# Altium project FMCW-Radar-v1.PrjPcb (part 2 of 3)

## Sheet Receiver-2.4GHz.SchDoc
size B; SheetNumber: 3; SheetTotal: 4
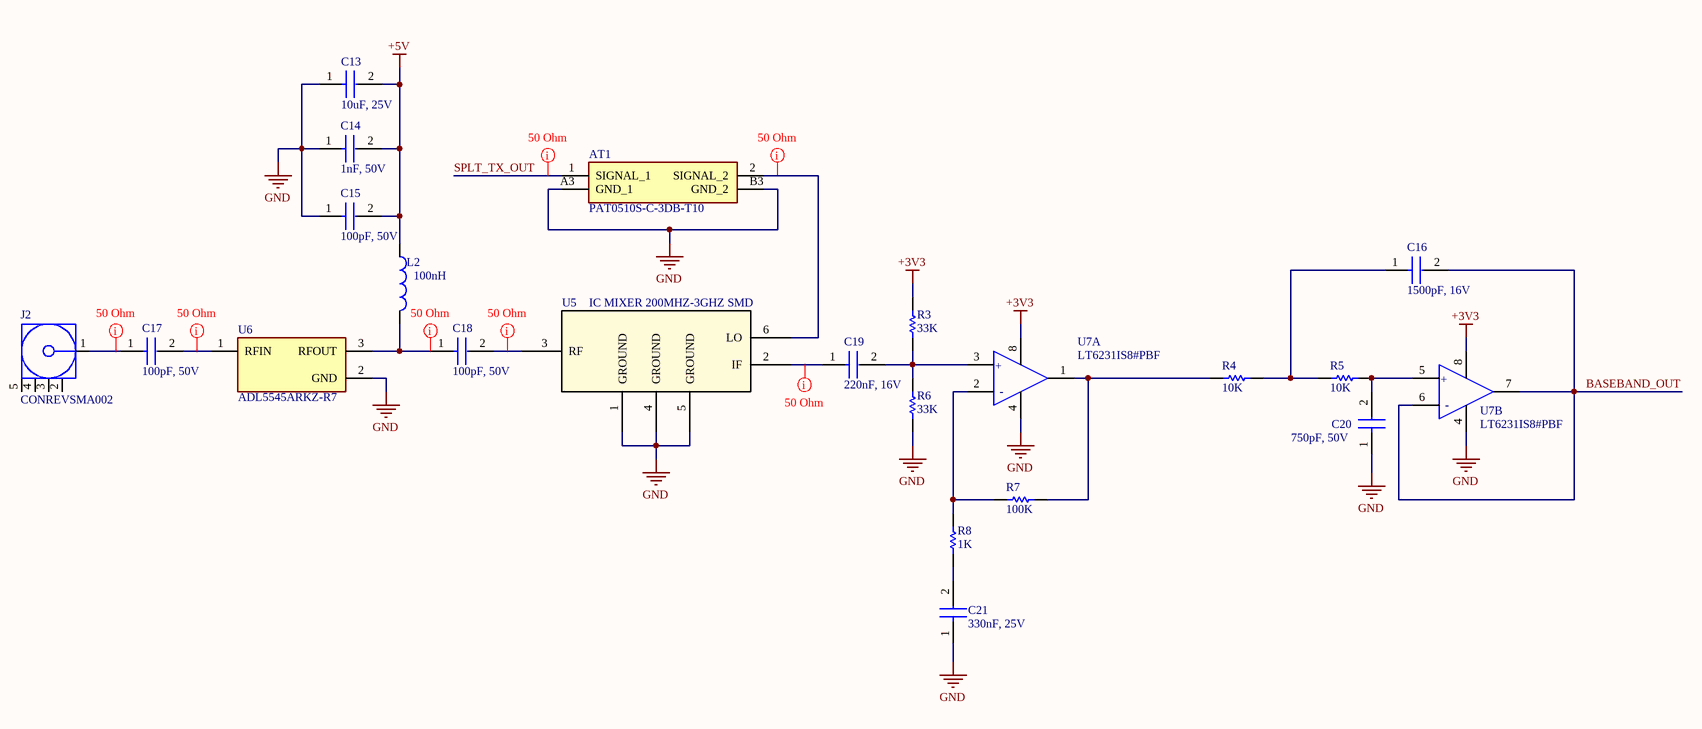
[diagram p2: Receiver-2.4GHz.SchDoc]

### Parts
AT1  PAT0510S-C-3DB-T10  [PAT0510SC3DBT10]
C13  10uF, 25V  [CAP_CL31_SAM]
C14  1nF, 50V  [FP-0603-L_1_6_0_15-W_0_81-IPC_C]
C15  100pF, 50V  [CAPC17595_87N_KEM]
C16  1500pF, 16V  [CAPC1005X55N]
C17  100pF, 50V  [CAP_CC0402_YAG]
C18  100pF, 50V  [CAP_CC0402_YAG]
C19  220nF, 16V  [FP-GRM155-0_05-IPC_C]
C20  750pF, 50V  [CAPC1005X55N]
C21  330nF, 25V  [CAP_CC0603_YAG-M]
J2  CONREVSMA002  [CON-REVSMA-RA]
L2  100nH  [INDC1608X95N]
R3  33K  [RESC1005X40N]
R4  10K  [RESC1005X37N]
R5  10K  [RESC1005X37N]
R6  33K  [RESC1005X40N]
R7  100K  [RESC1005X40N]
R8  1K  [FP-RC0402-0_4-IPC_C]
U5  IC MIXER 200MHZ-3GHZ SMD  [CD542_MNC]
U6  ADL5545ARKZ-R7  [ADL5545ARKZ-R7]
U7  LT6231IS8#PBF  [FP-LT6231IS8#PBF-IPC_C]  (parts A,B of 2)

### Nets
+3V3: R3.2 U7.8(V+)
+5V: C13.2 C14.2 C15.2 L2.1
GND: AT1.A3(GND_1) AT1.B3(GND_2) C13.1 C14.1 C15.1 C20.1 C21.1 R6.1 U5.1(GROUND) U5.4(GROUND) U5.5(GROUND) U6.2(GND) U7.4(V-)
BASEBAND_OUT: C16.2 U7.6(-IN_B) U7.7(OUT_B)
SPLT_TX_OUT: AT1.1(SIGNAL_1)
NetAT1_2: AT1.2(SIGNAL_2) U5.6(LO)
NetC16_1: C16.1 R4.2 R5.1
NetC17_1: C17.1 J2.1(Signal)
NetC17_2: C17.2 U6.1(RFIN)
NetC18_1: C18.1 L2.2 U6.3(RFOUT)
NetC18_2: C18.2 U5.3(RF)
NetC19_1: C19.1 U5.2(IF)
NetC19_2: C19.2 R3.1 R6.2 U7.3(+IN_A)
NetC20_2: C20.2 R5.2 U7.5(IN_B)
NetC21_2: C21.2 R8.2
NetR4_1: R4.1 R7.2 U7.1(OUT_A)
NetR7_1: R7.1 R8.1 U7.2(-IN_A)

Not connected (* = marked no-connect by the designer): J2 2(GND) 3(GND) 4(GND) 5(GND)

### Layout directives
net class RF_Trace: NetAT1_2, NetC17_1, NetC17_2, NetC18_1, NetC18_2, NetC19_1, SPLT_TX_OUT

### Notes on the sheet
- (in symbol LT6231IS8#PBF, part A) +; -
- (in symbol LT6231IS8#PBF, part B) +; -

### Library data of the parts
AT1 = PAT0510S-C-3DB-T10: Fixed Attenuator, 0MHz Min, 10000MHz Max; Manufacturer: Susumu; Attenuation-Nom: 3dB; Characteristic Impedance: 50R; Operating Frequency-Max: 10GHz; VSWR-Max: 1.3; Supplier: Digikey; Supplier Part Number: PAT05S3CT-ND; Manufacturer Part Number: PAT0510S-C-3DB-T10; RoHS: Yes; Category: Chip SMD Resistors; Stock: 205212; Pricing: 1=0.12, 10=0.1, 25=0.0936, 100=0.0853, 250=0.08036, 500=0.07684, 1000=0.07351, 5000=0.06646 (USD); Terminal Finish: Tin; JESD-609 Code: e3; Construction: COMPONENT; Operating Frequency-Min: 0MHz; RF/Microwave Device Type: FIXED ATTENUATOR; Reach SVHC Compliant: Yes; RoHS Compliant: Yes; ComponentLink1URL: https://datasheet.ciiva.com:443/pdfs/VipMasterIC/IC/SUSU/SUSU-S-A0003406171/SUSU-S-A0003406171-1.pdf?src-supplier=IHS+Markit; ComponentLink1Description: https://datasheet.ciiva.com:443/pdfs/VipMasterIC/IC/SUSU/SUSU-S-A0003406171/SUSU-S-A0003406171-1.pdf?src-supplier=IHS+Markit; ComponentLink2URL: https://datasheet.ciiva.com/15101/getdatasheetpartid-506863-15101147.pdf?src-supplier=Verical; ComponentLink2Description: https://datasheet.ciiva.com/15101/getdatasheetpartid-506863-15101147.pdf?src-supplier=Verical; ComponentLink3URL: https://datasheet.ciiva.com/2788/products-38-2788347.pdf?src-supplier=Digikey; ComponentLink3Description: https://datasheet.ciiva.com/2788/products-38-2788347.pdf?src-supplier=Digikey; ComponentLink4URL: https://datasheet.ciiva.com/2788/products-38-2788348.pdf?src-supplier=Digikey; ComponentLink4Description: https://datasheet.ciiva.com/2788/products-38-2788348.pdf?src-supplier=Digikey; ComponentLink5URL: https://datasheet.ciiva.com/2788/products-38-2788349.pdf?src-supplier=Digikey; ComponentLink5Description: https://datasheet.ciiva.com/2788/products-38-2788349.pdf?src-supplier=Digikey
C13 = CL31B106KAHNNNE: Ceramic Capacitor, Multilayer, Ceramic, 25V, 10% +Tol, 10% -Tol, X7R, 15% TC, 10uF, Surface Mount, 1206; Manufacturer: Samsung; Multilayer: Yes; Supplier: Digikey; Supplier Part Number: 1276-1804-1-ND; Manufacturer Part Number: CL31B106KAHNNNE; RoHS: Yes; Category: Ceramic Capacitors; Stock: 2651645; Pricing: 1=0.1, 10=0.043, 100=0.0358 (USD); Mounting Technology: Surface Mount; Pins: 2; Dielectric Material: Ceramic; Package Shape: Rectangular; Case/Package: 1206; Terminal Finish: Nickel; Min Operating Temperature: -55°C; Max Operating Temperature: 125°C; JESD-609 Code: e3; Value: 10uF; Capacitor Type: Ceramic; Tolerance  (fill in as +-): 10%; Package Style: SMTMeter; Packaging: Tape and Reel; Tolerance (fill in as +-): 10%; Rated DC Voltage (URdc): 25V; Temperature Characteristics Code: X7R; Termination: Wraparound; Length: 3.2mm; Width: 1.6mm; Height: 1.8mm; Reach SVHC Compliant: Yes; RoHS Compliant: Yes; ComponentLink1URL: https://datasheet.ciiva.com:443/pdfs/VipMasterIC/IC/SEMS/SEMS-S-A0008384515/SEMS-S-A0008872888-1.pdf?src-supplier=IHS+Markit; ComponentLink1Description: https://datasheet.ciiva.com:443/pdfs/VipMasterIC/IC/SEMS/SEMS-S-A0008384515/SEMS-S-A0008872888-1.pdf?src-supplier=IHS+Markit; ComponentLink2URL: https://datasheet.ciiva.com/25795/cl31b106kahnnne-25795260.pdf?src-supplier=Digikey; ComponentLink2Description: https://datasheet.ciiva.com/25795/cl31b106kahnnne-25795260.pdf?src-supplier=Digikey; ComponentLink3URL: https://datasheet.ciiva.com/26838/getdatasheetpartid-356415-26838914.pdf?src-supplier=Verical; ComponentLink3Description: https://datasheet.ciiva.com/26838/getdatasheetpartid-356415-26838914.pdf?src-supplier=Verical; ComponentLink4URL: https://datasheet.ciiva.com/16498/cl03a105mq3csnc-16498474.pdf?src-supplier=Future+Electronics; ComponentLink4Description: https://datasheet.ciiva.com/16498/cl03a105mq3csnc-16498474.pdf?src-supplier=Future+Electronics
C14 = 06035A102JAT2A: Ceramic Capacitor, Multilayer, Ceramic, 50V, 5% +Tol, 5% -Tol, C0G, 30ppm/Cel TC, 0.001uF, Surface Mount, 0603; Manufacturer: Kyocera AVX; Multilayer: Yes; Supplier: Avnet; Supplier Part Number: KGM15ACG1H102JT; Manufacturer Part Number: 06035A102JAT2A; RoHS: Yes; Category: Ceramic Capacitors; Stock: 540000; Pricing: 4000=0.00488, 8000=0.00454, 16000=0.00447, 24000=0.00439, 32000=0.00431 (USD); Mounting Technology: Surface Mount; Pins: 2; Dielectric Material: Ceramic; Package Shape: Rectangular; Case/Package: 0603; Terminal Finish: Nickel; Min Operating Temperature: -55°C; Max Operating Temperature: 125°C; JESD-609 Code: e3; Value: 1nF; Capacitor Type: Ceramic; Tolerance  (fill in as +-): 5%; Package Style: SMTMeter; Packaging: Tape and Reel; Tolerance (fill in as +-): 5%; Rated DC Voltage (URdc): 50V; Temperature Characteristics Code: C0G; Termination: Wraparound; Length: 1.6mm; Width: 0.81mm; Height: 0.9mm; RoHS Compliant: Yes; Reach SVHC Compliant: Yes; ComponentLink1URL: https://datasheet.ciiva.com:443/pdfs/VipMasterIC/IC/AVXC/AVXC-S-A0008899940/AVXC-S-A0008899940-1.pdf?src-supplier=IHS+Markit; ComponentLink1Description: https://datasheet.ciiva.com:443/pdfs/VipMasterIC/IC/AVXC/AVXC-S-A0008899940/AVXC-S-A0008899940-1.pdf?src-supplier=IHS+Markit; ComponentLink2URL: https://datasheet.ciiva.com/11786/0900766b802d4697-11786950.pdf?src-supplier=Rs; ComponentLink2Description: https://datasheet.ciiva.com/11786/0900766b802d4697-11786950.pdf?src-supplier=Rs; ComponentLink3URL: https://datasheet.ciiva.com/11464/ccog-11464573.pdf?src-supplier=Avnet; ComponentLink3Description: https://datasheet.ciiva.com/11464/ccog-11464573.pdf?src-supplier=Avnet; ComponentLink4URL: https://datasheet.ciiva.com/16363/ccog-16363640.pdf?src-supplier=Future+Electronics; ComponentLink4Description: https://datasheet.ciiva.com/16363/ccog-16363640.pdf?src-supplier=Future+Electronics; ComponentLink5URL: https://datasheet.ciiva.com/1124/759117-1124717.pdf?src-supplier=Element14; ComponentLink5Description: https://datasheet.ciiva.com/1124/759117-1124717.pdf?src-supplier=Element14; ComponentLink6URL: https://datasheet.ciiva.com/1124/759117-1124716.pdf?src-supplier=Element14; ComponentLink6Description: https://datasheet.ciiva.com/1124/759117-1124716.pdf?src-supplier=Element14; ComponentLink7URL: https://datasheet.ciiva.com/1466/26712-1466099.pdf?src-supplier=Farnell; ComponentLink7Description: https://datasheet.ciiva.com/1466/26712-1466099.pdf?src-supplier=Farnell; ComponentLink8URL: https://datasheet.ciiva.com/1124/26712-1124715.pdf?src-supplier=Element14; ComponentLink8Description: https://datasheet.ciiva.com/1124/26712-1124715.pdf?src-supplier=Element14; ComponentLink9URL: https://datasheet.ciiva.com/150/ccog-150886.pdf?src-supplier=Digikey; ComponentLink9Description: https://datasheet.ciiva.com/150/ccog-150886.pdf?src-supplier=Digikey; ComponentLink10URL: https://datasheet.ciiva.com/150/ccog-150885.pdf?src-supplier=Digikey; ComponentLink10Description: https://datasheet.ciiva.com/150/ccog-150885.pdf?src-supplier=Digikey; ComponentLink11URL: https://datasheet.ciiva.com/150/ccog-150887.pdf?src-supplier=Digikey; ComponentLink11Description: https://datasheet.ciiva.com/150/ccog-150887.pdf?src-supplier=Digikey; ComponentLink12URL: https://datasheet.ciiva.com/14585/70001039-14585948.pdf?src-supplier=Allied+Electronics; ComponentLink12Description: https://datasheet.ciiva.com/14585/70001039-14585948.pdf?src-supplier=Allied+Electronics
C15 = C0603C101J5GACTU: Ceramic Capacitor, Multilayer, Ceramic, 50V, 5% +Tol, 5% -Tol, C0G, 30ppm/Cel TC, 0.0001uF, Surface Mount, 0603; Manufacturer: KEMET; Multilayer: Yes; Supplier: Arrow Electronics; Supplier Part Number: C0603C101J5GACTU; Manufacturer Part Number: C0603C101J5GACTU; RoHS: Yes; Category: Ceramic Capacitors; Stock: 772000; Pricing: 4000=0.0155, 8000=0.0104 (USD); Mounting Technology: Surface Mount; Pins: 2; Dielectric Material: Ceramic; Package Shape: Rectangular; Case/Package: 0603; Terminal Finish: Nickel; Min Operating Temperature: -55°C; Max Operating Temperature: 125°C; JESD-609 Code: e3; Value: 100pF; Capacitor Type: Ceramic; Tolerance  (fill in as +-): 5%; Package Style: SMTMeter; Packaging: Tape and Reel; Tolerance (fill in as +-): 5%; Rated DC Voltage (URdc): 50V; Temperature Characteristics Code: C0G; Termination: Wraparound; Length: 1.6mm; Width: 0.8mm; Height: 0.8mm; Reach SVHC Compliant: Yes; RoHS Compliant: Yes; ComponentLink1URL: https://datasheet.ciiva.com:443/pdfs/VipMasterIC/IC/KEME/KEME-S-A0005605168/KEME-S-A0005605168-1.pdf?src-supplier=IHS+Markit; ComponentLink1Description: https://datasheet.ciiva.com:443/pdfs/VipMasterIC/IC/KEME/KEME-S-A0005605168/KEME-S-A0005605168-1.pdf?src-supplier=IHS+Markit; ComponentLink2URL: https://datasheet.ciiva.com/6126/f9080b-0402-series-c0g-6126680.pdf?src-supplier=Farnell; ComponentLink2Description: https://datasheet.ciiva.com/6126/f9080b-0402-series-c0g-6126680.pdf?src-supplier=Farnell; ComponentLink3URL: https://datasheet.ciiva.com/28645/1789732-28645525.pdf?src-supplier=Element14; ComponentLink3Description: https://datasheet.ciiva.com/28645/1789732-28645525.pdf?src-supplier=Element14; ComponentLink4URL: https://datasheet.ciiva.com/7823/1725423-7823564.pdf?src-supplier=Element14; ComponentLink4Description: https://datasheet.ciiva.com/7823/1725423-7823564.pdf?src-supplier=Element14; ComponentLink5URL: https://datasheet.ciiva.com/7823/1725423-7823565.pdf?src-supplier=Element14; ComponentLink5Description: https://datasheet.ciiva.com/7823/1725423-7823565.pdf?src-supplier=Element14; ComponentLink6URL: https://datasheet.ciiva.com/7823/f9080b-0402-series-c0g-7823964.pdf?src-supplier=Element14; ComponentLink6Description: https://datasheet.ciiva.com/7823/f9080b-0402-series-c0g-7823964.pdf?src-supplier=Element14; ComponentLink7URL: https://datasheet.ciiva.com/7823/1372242-7823965.pdf?src-supplier=Element14; ComponentLink7Description: https://datasheet.ciiva.com/7823/1372242-7823965.pdf?src-supplier=Element14
C16 = C0402C152F4HACAUTO: Ceramic Capacitor, Multilayer, Ceramic, 16V, 1% +Tol, 1% -Tol, X8R, 15% TC, 0.0015uF, Surface Mount, 0402; Manufacturer: KEMET; Supplier: Digikey; Supplier Part Number: 399-C0402C152F4HACAUTOCT-ND; Manufacturer Part Number: C0402C152F4HACAUTO; RoHS: Yes; Category: Ceramic Capacitors; Stock: 19436; Pricing: 1=0.21, 10=0.119, 100=0.0745, 1000=0.05163, 2500=0.0442, 5000=0.04255 (USD); Pins: 2; Dielectric Material: Ceramic; Capacitor Type: Ceramic; Reach SVHC Compliant: Yes; RoHS Compliant: Yes; ComponentLink1URL: https://datasheet.ciiva.com:443/pdfs/VipMasterIC/IC/KEME/KEME-S-A0008958458/KEME-S-A0008958458-1.pdf?src-supplier=IHS+Markit; ComponentLink1Description: https://datasheet.ciiva.com:443/pdfs/VipMasterIC/IC/KEME/KEME-S-A0008958458/KEME-S-A0008958458-1.pdf?src-supplier=IHS+Markit; ComponentLink2URL: https://api.kemet.com/component-edge/download/datasheet/C0402C152F4HACAUTO.pdf?src-supplier=Digikey; ComponentLink2Description: https://api.kemet.com/component-edge/download/datasheet/C0402C152F4HACAUTO.pdf?src-supplier=Digikey
C17 C18 = CC0402JRNPO9BN101: Ceramic Capacitor, Multilayer, Ceramic, 50V, 5% +Tol, 5% -Tol, C0G, 30ppm/Cel TC, 0.0001uF, Surface Mount, 0402; Manufacturer: Yageo; Multilayer: Yes; Supplier: Digikey; Supplier Part Number: 311-1024-1-ND; Manufacturer Part Number: CC0402JRNPO9BN101; RoHS: Yes; Category: Ceramic Capacitors; Stock: 5534890; Pricing: 1=0.08, 10=0.013, 100=0.008, 1000=0.0056, 2500=0.004, 10000=0.0032 (USD); Mounting Technology: Surface Mount; Pins: 2; Dielectric Material: Ceramic; Package Shape: Rectangular; Case/Package: 0402; Terminal Finish: Nickel; Min Operating Temperature: -55°C; Max Operating Temperature: 125°C; JESD-609 Code: e3; Value: 100pF; Capacitor Type: Ceramic; Tolerance  (fill in as +-): 5%; Package Style: SMTMeter; Packaging: Tape and Reel; Tolerance (fill in as +-): 5%; Rated DC Voltage (URdc): 50V; Temperature Characteristics Code: C0G; Termination: Wraparound; Length: 1mm; Width: 0.5mm; Height: 0.5mm; Reach SVHC Compliant: Yes; RoHS Compliant: Yes; ComponentLink1URL: https://datasheet.ciiva.com:443/pdfs/VipMasterIC/IC/YAGO/YAGO-S-A0009251638/YAGO-S-A0009251638-1.pdf?src-supplier=IHS+Markit; ComponentLink1Description: https://datasheet.ciiva.com:443/pdfs/VipMasterIC/IC/YAGO/YAGO-S-A0009251638/YAGO-S-A0009251638-1.pdf?src-supplier=IHS+Markit; ComponentLink2URL: https://datasheet.ciiva.com/23767/25787-23767888.pdf?src-supplier=Newark; ComponentLink2Description: https://datasheet.ciiva.com/23767/25787-23767888.pdf?src-supplier=Newark; ComponentLink3URL: https://datasheet.ciiva.com/11786/0900766b80d84fbf-11786101.pdf?src-supplier=Rs; ComponentLink3Description: https://datasheet.ciiva.com/11786/0900766b80d84fbf-11786101.pdf?src-supplier=Rs; ComponentLink4URL: https://datasheet.ciiva.com/28450/1443161-28450220.pdf?src-supplier=Element14; ComponentLink4Description: https://datasheet.ciiva.com/28450/1443161-28450220.pdf?src-supplier=Element14; ComponentLink5URL: https://datasheet.ciiva.com/143/mlccorderingcode-143989.pdf?src-supplier=Digikey; ComponentLink5Description: https://datasheet.ciiva.com/143/mlccorderingcode-143989.pdf?src-supplier=Digikey; ComponentLink6URL: https://datasheet.ciiva.com/143/mlccorderingcode-143990.pdf?src-supplier=Digikey; ComponentLink6Description: https://datasheet.ciiva.com/143/mlccorderingcode-143990.pdf?src-supplier=Digikey; ComponentLink7URL: https://datasheet.ciiva.com/143/mlccorderingcode-143991.pdf?src-supplier=Digikey; ComponentLink7Description: https://datasheet.ciiva.com/143/mlccorderingcode-143991.pdf?src-supplier=Digikey; ComponentLink8URL: https://datasheet.ciiva.com/8033/1443161-8033598.pdf?src-supplier=Element14; ComponentLink8Description: https://datasheet.ciiva.com/8033/1443161-8033598.pdf?src-supplier=Element14
C19 = GRM155R71C224KA12D: Ceramic Capacitor, Multilayer, Ceramic, 16V, 10% +Tol, 10% -Tol, X7R, 15% TC, 0.22uF, Surface Mount, 0402; Manufacturer: Murata; Multilayer: Yes; Supplier: Digikey; Supplier Part Number: 490-5418-1-ND; Manufacturer Part Number: GRM155R71C224KA12D; RoHS: Yes; Category: Ceramic Capacitors; Stock: 303816; Pricing: 1=0.1, 10=0.027, 50=0.027, 100=0.018, 1000=0.012, 10000=0.008 (USD); Mounting Technology: Surface Mount; Pins: 2; Dielectric Material: Ceramic; Package Shape: Rectangular; Case/Package: 0402; Terminal Finish: Nickel; Min Operating Temperature: -55°C; Max Operating Temperature: 125°C; JESD-609 Code: e3; Value: 220nF; Capacitor Type: Ceramic; Tolerance  (fill in as +-): 10%; Package Style: SMTMeter; Packaging: Tape and Reel; Tolerance (fill in as +-): 10%; Rated DC Voltage (URdc): 16V; Temperature Characteristics Code: X7R; Termination: Wraparound; Length: 1mm; Width: 0.5mm; Height: 0.5mm; Reach SVHC Compliant: Yes; RoHS Compliant: Yes; ComponentLink1URL: https://datasheet.ciiva.com:443/pdfs/VipMasterIC/IC/MURE/MURE-S-A0008911298/MURE-S-A0008911313-1.pdf?src-supplier=IHS+Markit; ComponentLink1Description: https://datasheet.ciiva.com:443/pdfs/VipMasterIC/IC/MURE/MURE-S-A0008911298/MURE-S-A0008911313-1.pdf?src-supplier=IHS+Markit; ComponentLink2URL: https://datasheet.ciiva.com/132/product-132672.pdf?src-supplier=Digikey; ComponentLink2Description: https://datasheet.ciiva.com/132/product-132672.pdf?src-supplier=Digikey; ComponentLink3URL: https://datasheet.ciiva.com/18184/getdatasheetpartid-347270-18184668.pdf?src-supplier=Verical; ComponentLink3Description: https://datasheet.ciiva.com/18184/getdatasheetpartid-347270-18184668.pdf?src-supplier=Verical; ComponentLink4URL: https://datasheet.ciiva.com/29199/454127-da-01-en-vs-kondensator-0402-29199807.pdf?src-supplier=Conrad; ComponentLink4Description: https://datasheet.ciiva.com/29199/454127-da-01-en-vs-kondensator-0402-29199807.pdf?src-supplier=Conrad; ComponentLink5URL: https://datasheet.ciiva.com/132/partnumbering-e-01-132670.pdf?src-supplier=Digikey; ComponentLink5Description: https://datasheet.ciiva.com/132/partnumbering-e-01-132670.pdf?src-supplier=Digikey; ComponentLink6URL: https://datasheet.ciiva.com/132/partnumbering-e-01-132671.pdf?src-supplier=Digikey; ComponentLink6Description: https://datasheet.ciiva.com/132/partnumbering-e-01-132671.pdf?src-supplier=Digikey; ComponentLink7URL: https://datasheet.ciiva.com/48671/product-48671325.pdf?src-supplier=Avnet; ComponentLink7Description: https://datasheet.ciiva.com/48671/product-48671325.pdf?src-supplier=Avnet; ComponentLink8URL: https://datasheet.ciiva.com/16467/product-16467307.pdf?src-supplier=Future+Electronics; ComponentLink8Description: https://datasheet.ciiva.com/16467/product-16467307.pdf?src-supplier=Future+Electronics
C20 = GCM1555C1H751FA16D: Ceramic Capacitor, Multilayer, Ceramic, 50V, 1% +Tol, 1% -Tol, C0G, 30ppm/Cel TC, 0.00075uF, Surface Mount, 0402; Manufacturer: Murata; Multilayer: Yes; Reference Standard: AEC-Q200; Supplier: Digikey; Supplier Part Number: 490-GCM1555C1H751FA16DCT-ND; Manufacturer Part Number: GCM1555C1H751FA16D; RoHS: Yes; Category: Ceramic Capacitors; Stock: 11851; Pricing: 1=0.1, 10=0.044, 100=0.026, 1000=0.01666, 2500=0.01436, 5000=0.01297 (USD); Mounting Technology: Surface Mount; Pins: 2; Dielectric Material: Ceramic; Package Shape: Rectangular; Case/Package: 0402; Terminal Finish: Nickel; Min Operating Temperature: -55°C; Max Operating Temperature: 125°C; JESD-609 Code: e3; Value: 750pF; Capacitor Type: Ceramic; Tolerance  (fill in as +-): 1%; Packaging: Tape and Reel; Tolerance (fill in as +-): 1%; Rated DC Voltage (URdc): 50V; Temperature Characteristics Code: C0G; Termination: Wraparound; Reach SVHC Compliant: Yes; RoHS Compliant: Yes; ComponentLink1URL: https://psearch.en.murata.com:443/capacitor/product/GCM1555C1H751FA16%23.pdf?src-supplier=IHS+Markit; ComponentLink1Description: https://psearch.en.murata.com:443/capacitor/product/GCM1555C1H751FA16%23.pdf?src-supplier=IHS+Markit
C21 = CC0603JRX7R8BB334: Ceramic Capacitor, Multilayer, Ceramic, 25V, 5% +Tol, 5% -Tol, X7R, 15% TC, 0.33uF, Surface Mount, 0603; Manufacturer: Yageo; Multilayer: Yes; Supplier: Digikey; Supplier Part Number: 13-CC0603JRX7R8BB334CT-ND; Manufacturer Part Number: CC0603JRX7R8BB334; RoHS: Yes; Category: Ceramic Capacitors; Stock: 30027; Pricing: 1=0.15, 10=0.086, 100=0.0527, 1000=0.03562 (USD); Pins: 2; Dielectric Material: Ceramic; Case/Package: 0603; Terminal Finish: Nickel; Min Operating Temperature: -55°C; Max Operating Temperature: 125°C; JESD-609 Code: e3; Value: 330nF; Capacitor Type: Ceramic; Tolerance  (fill in as +-): 5%; Package Style: SMTMeter; Packaging: Tape and Reel; Tolerance (fill in as +-): 5%; Rated DC Voltage (URdc): 25V; Series: SIZE(X7R); Temperature Characteristics Code: X7R; Length: 1.6mm; Width: 0.8mm; Height: 0.8mm; Reach SVHC Compliant: Yes; RoHS Compliant: Yes
J2 = CONREVSMA002: RF SMA Connector; Manufacturer: Linx; Supplier: Digikey; Supplier Part Number: CONREVSMA002-ND; Manufacturer Part Number: CONREVSMA002; RoHS: Yes; Category: RF / Coaxial Connectors; Stock: 5396; Pricing: 1=2.78, 250=2.58, 500=2.41002, 1000=2.2625 (USD); Connector Type: SMA; Reach SVHC Compliant: Yes; RoHS Compliant: Yes; ComponentLink1URL: https://datasheet.ciiva.com:443/pdfs/VipMasterIC/IC/LNNC/LNNC-S-A0004850234/LNNC-S-A0004850234-1.pdf?src-supplier=IHS+Markit; ComponentLink1Description: https://datasheet.ciiva.com:443/pdfs/VipMasterIC/IC/LNNC/LNNC-S-A0004850234/LNNC-S-A0004850234-1.pdf?src-supplier=IHS+Markit; ComponentLink2URL: https://datasheet.ciiva.com/644/conrevsma002-644109.pdf?src-supplier=Digikey; ComponentLink2Description: https://datasheet.ciiva.com/644/conrevsma002-644109.pdf?src-supplier=Digikey; ComponentLink3URL: https://datasheet.ciiva.com/16225/conrevsma002-16225213.pdf?src-supplier=Future+Electronics; ComponentLink3Description: https://datasheet.ciiva.com/16225/conrevsma002-16225213.pdf?src-supplier=Future+Electronics
L2 = LQG18HNR10J00D: General Purpose Inductor, 0.1uH, 5%, 1 Element, Air-Core, SMD, 0603; Manufacturer: Murata; Core Material: Air; Case/Size Code: 0603; DC Resistance (DCR): 900mR; Inductor Application: RF INDUCTOR; Channels: 1; Quality Factor-Min (at L-nom): 12; Max Current Rating: 350mA; Self Resonant Frequency: 800MHz; Shape/Size Description: RECTANGULAR PACKAGE; Shielding: Unshielded; Test Frequency: 100MHz; Package Height: 0.8mm; Package Length: 1.6mm; Supplier: Mouser; Supplier Part Number: 81-LQG18HNR10J00D; Manufacturer Part Number: LQG18HNR10J00D; RoHS: Yes; Category: Fixed Inductors; Stock: 24486; Pricing: 1=0.18, 10=0.144, 50=0.144, 100=0.119, 1000=0.098, 10000=0.066 (USD); Pins: 2; Terminal Finish: Tin; Min Operating Temperature: -40°C; Max Operating Temperature: 85°C; Tolerance: 5%; JESD-609 Code: e3; Construction: Multilayer Chip; Inductance-Nom (L): 0.1uH; Inductor Type: GENERAL PURPOSE INDUCTOR; Package Style: SMTMeter; Packaging: Tape and Reel; Surface Mount: Yes; Terminal Placement: Dual Ended; Termination: Wraparound; Package Width: 0.8mm; Reach SVHC Compliant: Yes; RoHS Compliant: Yes; ComponentLink1URL: https://datasheet.ciiva.com:443/pdfs/VipMasterIC/IC/MURE/MURE-S-A0008911298/MURE-S-A0008911379-1.pdf?src-supplier=IHS+Markit; ComponentLink1Description: https://datasheet.ciiva.com:443/pdfs/VipMasterIC/IC/MURE/MURE-S-A0008911298/MURE-S-A0008911379-1.pdf?src-supplier=IHS+Markit; ComponentLink2URL: https://datasheet.ciiva.com/11801/0900766b80f1087c-11801431.pdf?src-supplier=Rs; ComponentLink2Description: https://datasheet.ciiva.com/11801/0900766b80f1087c-11801431.pdf?src-supplier=Rs; ComponentLink3URL: https://datasheet.ciiva.com/6710/l0075s0083lqg18h-6710060.pdf?src-supplier=Digikey; ComponentLink3Description: https://datasheet.ciiva.com/6710/l0075s0083lqg18h-6710060.pdf?src-supplier=Digikey; ComponentLink4URL: https://datasheet.ciiva.com/6710/l0075s0083lqg18h-6710062.pdf?src-supplier=Digikey; ComponentLink4Description: https://datasheet.ciiva.com/6710/l0075s0083lqg18h-6710062.pdf?src-supplier=Digikey; ComponentLink5URL: https://datasheet.ciiva.com/8002/5102-8002605.pdf?src-supplier=Element14; ComponentLink5Description: https://datasheet.ciiva.com/8002/5102-8002605.pdf?src-supplier=Element14; ComponentLink6URL: https://datasheet.ciiva.com/8002/5102-8002606.pdf?src-supplier=Element14; ComponentLink6Description: https://datasheet.ciiva.com/8002/5102-8002606.pdf?src-supplier=Element14
R3 R6 = CRGCQ0402F33K: Fixed Resistor, Metal Glaze/thick Film, 0.0625W, 33000ohm, 50V, 1% +/-Tol, 100ppm/Cel, Surface Mount, 0402; Manufacturer: TE Connectivity; Supplier: Digikey; Supplier Part Number: A129645CT-ND; Manufacturer Part Number: CRGCQ0402F33K; RoHS: Yes; Category: Chip SMD Resistors; Stock: 860508; Pricing: 1=0.1, 10=0.025, 100=0.0121, 1000=0.00663, 2500=0.00542, 5000=0.00473 (USD); Pins: 2; Resistor Type: FIXED RESISTOR; Reach SVHC Compliant: Yes; RoHS Compliant: Yes; ComponentLink1URL: https://datasheet.ciiva.com:443/pdfs/VipMasterIC/IC/TYEL/TYEL-S-A0009513709/TYEL-S-A0009515791-1.pdf?src-supplier=IHS+Markit; ComponentLink1Description: https://datasheet.ciiva.com:443/pdfs/VipMasterIC/IC/TYEL/TYEL-S-A0009513709/TYEL-S-A0009515791-1.pdf?src-supplier=IHS+Markit; ComponentLink2URL: https://www.te.com/commerce/DocumentDelivery/DDEController?Action=srchrtrv&amp;DocNm=1773204-3&amp;DocType=DS&amp;DocLang=English&src-supplier=Digikey; ComponentLink2Description: https://www.te.com/commerce/DocumentDelivery/DDEController?Action=srchrtrv&amp;DocNm=1773204-3&amp;DocType=DS&amp;DocLang=English&src-supplier=Digikey; ComponentLink3URL: https://datasheet.octopart.com/CRGCQ0402F33K-TE-Connectivity-datasheet-114679081.pdf?src-supplier=Master+Electronics; ComponentLink3Description: https://datasheet.octopart.com/CRGCQ0402F33K-TE-Connectivity-datasheet-114679081.pdf?src-supplier=Master+Electronics
R4 R5 = AC0402FR-0710KL: Fixed Resistor, Metal Glaze/thick Film, 0.0625W, 10000ohm, 50V, 1% +/-Tol, 100ppm/Cel, Surface Mount, 0402; Manufacturer: Yageo; Additional Feature: LASER TRIMMABLE; Power: 62.5mW; Rated Temperature: 70°C; Value: 10kR; Temperature Coefficient (ppm/Cel): 100; Package Height: 0.32mm; Package Length: 1mm; Package Width: 0.5mm; Reference Standard: AEC-Q200; Supplier: Digikey; Supplier Part Number: YAG3436CT-ND; Manufacturer Part Number: AC0402FR-0710KL; RoHS: Yes; Category: Chip SMD Resistors; Stock: 889565; Pricing: 1=0.1, 10=0.009, 100=0.0082, 1000=0.00612, 2500=0.0051, 5000=0.00407 (USD); Mounting Technology: Surface Mount; Pins: 2; Package Shape: Rectangular; Case/Package: 0402; Terminal Finish: Nickel; Min Operating Temperature: -55°C; Max Operating Temperature: 155°C; Tolerance: 1%; JESD-609 Code: e3; Resistor Type: FIXED RESISTOR; Construction: Chip; Packaging: Tape and Reel; Technology: METAL GLAZE/THICK FILM; Termination: Wraparound; Working Voltage: 50V; Reach SVHC Compliant: Yes; RoHS Compliant: Yes; ComponentLink1URL: https://datasheet.ciiva.com:443/pdfs/VipMasterIC/IC/YAGO/YAGO-S-A0003597364/YAGO-S-A0003597364-1.pdf?src-supplier=IHS+Markit; ComponentLink1Description: https://datasheet.ciiva.com:443/pdfs/VipMasterIC/IC/YAGO/YAGO-S-A0003597364/YAGO-S-A0003597364-1.pdf?src-supplier=IHS+Markit; ComponentLink2URL: https://datasheet.ciiva.com/12656/pyu-ac-51-rohs-l-2-12656634.pdf?src-supplier=Mouser; ComponentLink2Description: https://datasheet.ciiva.com/12656/pyu-ac-51-rohs-l-2-12656634.pdf?src-supplier=Mouser
R7 = RC0402FR-07300KL: Fixed Resistor, Metal Glaze/thick Film, 0.0625W, 300000ohm, 50V, 1% +/-Tol, 100ppm/Cel, Surface Mount, 0402; Manufacturer: Yageo; Additional Feature: LASER TRIMMABLE; Power: 62.5mW; Rated Temperature: 70°C; Value: 300kR; Temperature Coefficient (ppm/Cel): 100; Package Height: 0.35mm; Package Length: 1mm; Package Width: 0.5mm; Supplier: Digikey; Supplier Part Number: 311-300KLRCT-ND; Manufacturer Part Number: RC0402FR-07300KL; RoHS: Yes; Category: Chip SMD Resistors; Stock: 802480; Pricing: 1=0.1, 10=0.007, 100=0.0061, 1000=0.00408, 2500=0.00357 (USD); Mounting Technology: Surface Mount; Pins: 2; Package Shape: Rectangular; Case/Package: 0402; Terminal Finish: Nickel; Min Operating Temperature: -55°C; Max Operating Temperature: 155°C; Tolerance: 1%; JESD-609 Code: e3; Resistor Type: FIXED RESISTOR; Construction: Chip; Packaging: Tape and Reel; Technology: METAL GLAZE/THICK FILM; Termination: Wraparound; Working Voltage: 50V; Reach SVHC Compliant: Yes; RoHS Compliant: Yes; ComponentLink1URL: https://datasheet.ciiva.com:443/pdfs/VipMasterIC/IC/YAGO/YAGO-S-A0008145938/YAGO-S-A0008145938-1.pdf?src-supplier=IHS+Markit; ComponentLink1Description: https://datasheet.ciiva.com:443/pdfs/VipMasterIC/IC/YAGO/YAGO-S-A0008145938/YAGO-S-A0008145938-1.pdf?src-supplier=IHS+Markit; ComponentLink2URL: https://datasheet.ciiva.com/16771/pyu-rc0402-51-rohs-l-6-r-16771583.pdf?src-supplier=Future+Electronics; ComponentLink2Description: https://datasheet.ciiva.com/16771/pyu-rc0402-51-rohs-l-6-r-16771583.pdf?src-supplier=Future+Electronics
R8 = RC0402FR-071KL: Fixed Resistor, Metal Glaze/thick Film, 0.0625W, 1000ohm, 50V, 1% +/-Tol, 100ppm/Cel, Surface Mount, 0402; Manufacturer: Yageo; Additional Feature: LASER TRIMMABLE; Power: 62.5mW; Rated Temperature: 70°C; Value: 1kR; Temperature Coefficient (ppm/Cel): 100; Package Height: 0.35mm; Package Length: 1mm; Package Width: 0.5mm; Supplier: Digikey; Supplier Part Number: 311-1.00KLRTR-ND; Manufacturer Part Number: RC0402FR-071KL; RoHS: Yes; Category: Chip SMD Resistors; Stock: 1112186; Pricing: 10000=0.00204, 20000=0.002, 30000=0.00181, 50000=0.0017, 70000=0.00161 (USD); Mounting Technology: Surface Mount; Pins: 2; Package Shape: Rectangular; Case/Package: 0402; Terminal Finish: Nickel; Min Operating Temperature: -55°C; Max Operating Temperature: 155°C; Tolerance: 1%; JESD-609 Code: e3; Resistor Type: FIXED RESISTOR; Construction: Chip; Packaging: Tape and Reel; Technology: METAL GLAZE/THICK FILM; Termination: Wraparound; Working Voltage: 50V; Reach SVHC Compliant: Yes; RoHS Compliant: Yes; ComponentLink1URL: https://datasheet.ciiva.com:443/pdfs/VipMasterIC/IC/YAGO/YAGO-S-A0008145938/YAGO-S-A0008145938-1.pdf?src-supplier=IHS+Markit; ComponentLink1Description: https://datasheet.ciiva.com:443/pdfs/VipMasterIC/IC/YAGO/YAGO-S-A0008145938/YAGO-S-A0008145938-1.pdf?src-supplier=IHS+Markit; ComponentLink2URL: https://datasheet.ciiva.com/11819/0900766b80c66297-11819477.pdf?src-supplier=Rs; ComponentLink2Description: https://datasheet.ciiva.com/11819/0900766b80c66297-11819477.pdf?src-supplier=Rs; ComponentLink3URL: https://datasheet.ciiva.com/7849/1018594-7849869.pdf?src-supplier=Element14; ComponentLink3Description: https://datasheet.ciiva.com/7849/1018594-7849869.pdf?src-supplier=Element14; ComponentLink4URL: https://datasheet.ciiva.com/7849/1018594-7849871.pdf?src-supplier=Element14; ComponentLink4Description: https://datasheet.ciiva.com/7849/1018594-7849871.pdf?src-supplier=Element14; ComponentLink5URL: https://datasheet.ciiva.com/7983/1018594-7983502.pdf?src-supplier=Element14; ComponentLink5Description: https://datasheet.ciiva.com/7983/1018594-7983502.pdf?src-supplier=Element14; ComponentLink6URL: https://datasheet.ciiva.com/22747/1018594-22747513.pdf?src-supplier=Element14; ComponentLink6Description: https://datasheet.ciiva.com/22747/1018594-22747513.pdf?src-supplier=Element14; ComponentLink7URL: https://datasheet.ciiva.com/17063/pyu-rc0402-51-rohs-l-6-r-17063193.pdf?src-supplier=Future+Electronics; ComponentLink7Description: https://datasheet.ciiva.com/17063/pyu-rc0402-51-rohs-l-6-r-17063193.pdf?src-supplier=Future+Electronics; ComponentLink8URL: https://datasheet.ciiva.com/12666/pyu-rc0402-51-rohs-l-6-r-12666741.pdf?src-supplier=Mouser; ComponentLink8Description: https://datasheet.ciiva.com/12666/pyu-rc0402-51-rohs-l-6-r-12666741.pdf?src-supplier=Mouser
U5 = ADE-30+
U6 = ADL5545ARKZ-R7: Wide Band Medium Power Amplifier, 30MHz Min, 6000MHz Max, 1 Func, BIPolar; Manufacturer: Analog Devices; Supplier: Digikey; Supplier Part Number: 505-ADL5545ARKZ-R7CT-ND; Manufacturer Part Number: ADL5545ARKZ-R7; RoHS: Yes; Category: RF Amplifiers; Stock: 532; Pricing: 1=4.14, 10=3.577, 25=3.3816, 100=3.1132, 250=2.95236, 500=2.83876 (USD); RF/Microwave Device Type: WIDE BAND MEDIUM POWER; Reach SVHC Compliant: Yes; RoHS Compliant: Yes; ComponentLink1URL: https://datasheet.ciiva.com:443/pdfs/VipMasterIC/IC/ANDI/ANDIS19839/ANDIS19839-1.pdf?src-supplier=IHS+Markit; ComponentLink1Description: https://datasheet.ciiva.com:443/pdfs/VipMasterIC/IC/ANDI/ANDIS19839/ANDIS19839-1.pdf?src-supplier=IHS+Markit; ComponentLink2URL: https://datasheet.ciiva.com/18576/adl5545-18576150.pdf?src-supplier=Digikey; ComponentLink2Description: https://datasheet.ciiva.com/18576/adl5545-18576150.pdf?src-supplier=Digikey; ComponentLink3URL: https://datasheet.ciiva.com/22628/1800592-22628003.pdf?src-supplier=Element14; ComponentLink3Description: https://datasheet.ciiva.com/22628/1800592-22628003.pdf?src-supplier=Element14; ComponentLink4URL: https://datasheet.ciiva.com/18576/adl5545-18576151.pdf?src-supplier=Digikey; ComponentLink4Description: https://datasheet.ciiva.com/18576/adl5545-18576151.pdf?src-supplier=Digikey; ComponentLink5URL: https://datasheet.ciiva.com/18576/adl5545-18576152.pdf?src-supplier=Digikey; ComponentLink5Description: https://datasheet.ciiva.com/18576/adl5545-18576152.pdf?src-supplier=Digikey
U7 = LT6231IS8#PBF: Operational Amplifier, 2 Func, 550uV Offset-Max, PDSO8; Manufacturer: Analog Devices / Linear Technology; Package Body Material: Plastic; Average Bias Current-Max (IIB): 12uA; Common-mode Reject Ratio-Nom: 95dB; Neg Supply Voltage Limit-Max: -6.3V; Neg Supply Voltage-Nom (Vsup): -5V; Channels: 2; Slew Rate: 260V/µs; Supply Voltage Limit-Max: 6.3V; Nominal Supply Voltage: 5V; Time @ Peak Reflow Temperature-Max (s): 30s; Unity Gain BW-Nom: 215MHz; Qualification Status: Not Qualified; Supplier: Digikey; Supplier Part Number: 505-LT6231IS8#PBF-ND; Manufacturer Part Number: LT6231IS8#PBF; RoHS: Yes; Category: Amplifiers - Op Amps, Buffer, Instrumentation; Stock: 9166; Pricing: 1=7.31, 10=4.917, 25=4.2932, 100=3.7375 (USD); Case/Package: SOP; Pins: 8; Package Shape: Rectangular; Terminal Finish: Tin; Min Operating Temperature: -40°C; Max Operating Temperature: 85°C; JESD-609 Code: e3; Amplifier Type: OPERATIONAL AMPLIFIER; Input Offset Voltage-Max: 550uV; JESD-30 Code: R-PDSO-G8; Moisture Sensitivity Level: 1; Package Style: SMALL OUTLINEMeter; Peak Reflow Temperature (Cel): 260°C; Surface Mount: Yes; Terminal Form: Gull Wing; Terminal Position: DUAL; Length: 4.9mm; Width: 3.9mm; Height - Seated (Max): 1.752mm; Terminal Pitch: 1.27mm; Temperature Grade: INDUSTRIAL; Reach SVHC Compliant: Yes; RoHS Compliant: Yes; ComponentLink1URL: https://datasheet.ciiva.com:443/pdfs/VipMasterIC/IC/LITC/LITCS10845/LITCS10845-1.pdf?src-supplier=IHS+Markit; ComponentLink1Description: https://datasheet.ciiva.com:443/pdfs/VipMasterIC/IC/LITC/LITCS10845/LITCS10845-1.pdf?src-supplier=IHS+Markit; ComponentLink2URL: https://datasheet.ciiva.com/1802/2098-1802952.pdf?src-supplier=Digikey; ComponentLink2Description: https://datasheet.ciiva.com/1802/2098-1802952.pdf?src-supplier=Digikey; ComponentLink3URL: https://datasheet.ciiva.com/22637/1599634-22637797.pdf?src-supplier=Element14; ComponentLink3Description: https://datasheet.ciiva.com/22637/1599634-22637797.pdf?src-supplier=Element14; ComponentLink4URL: https://datasheet.ciiva.com/48705/001255199-da-01-en-ic-op-amp-dual-lt6231is8-pbf-soic-8-ltc-48705643.pdf?src-supplier=Conrad; ComponentLink4Description: https://datasheet.ciiva.com/48705/001255199-da-01-en-ic-op-amp-dual-lt6231is8-pbf-soic-8-ltc-48705643.pdf?src-supplier=Conrad